# Altium schematic sheet Display.Schematic.SchDoc
size A
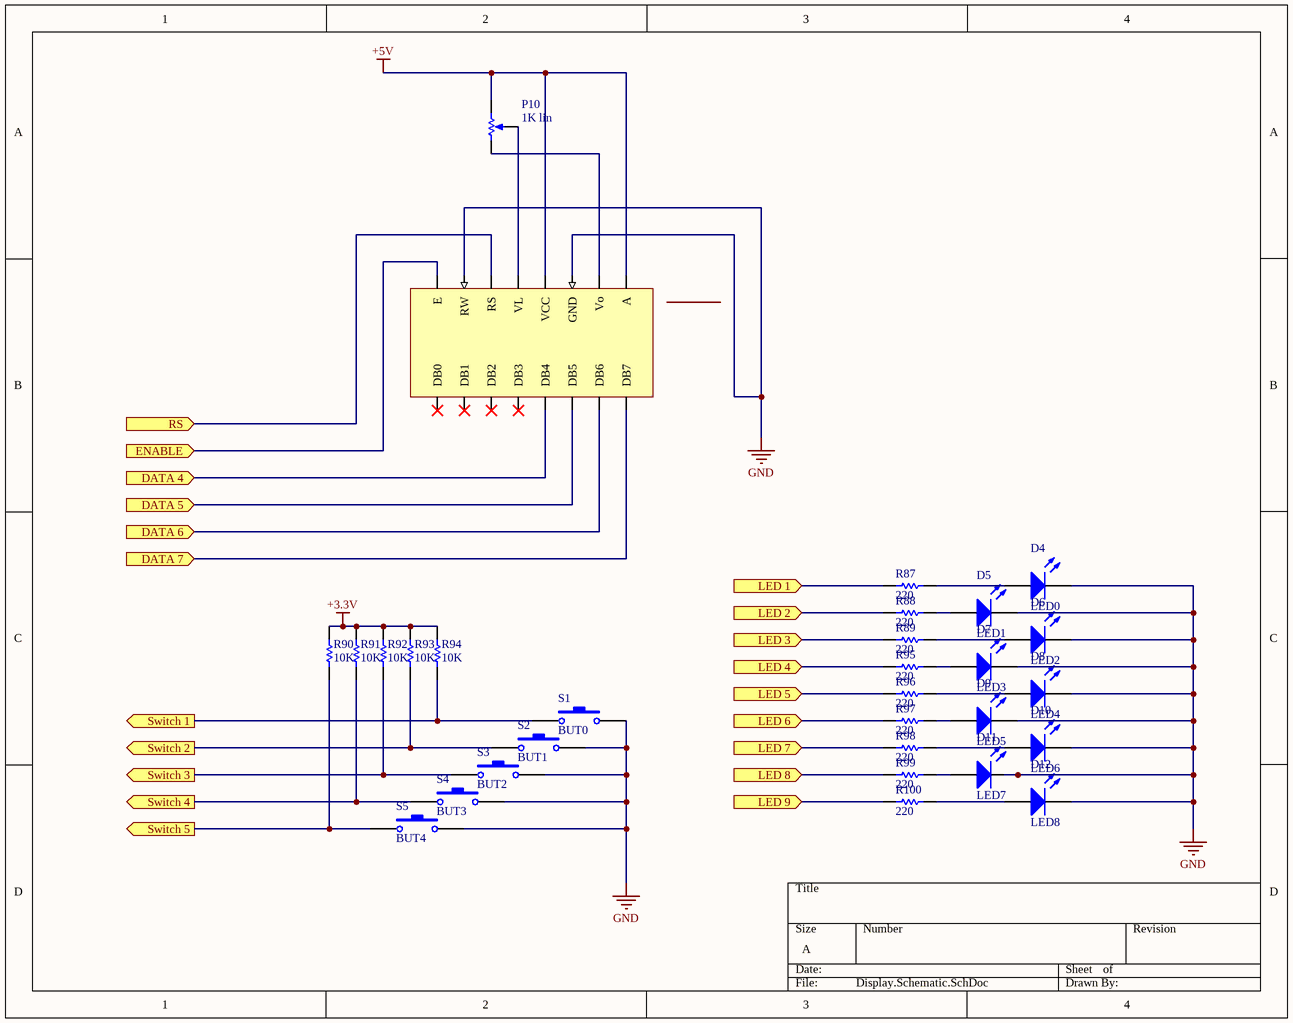
[diagram p0: Display.Schematic.SchDoc]

## Parts
D4  LED0  [LED]
D5  LED1  [LED]
D6  LED2  [LED]
D7  LED3  [LED]
D8  LED4  [LED]
D9  LED5  [LED]
D10  LED6  [LED]
D11  LED7  [LED]
D12  LED8  [LED]
Display1  16x2 LCD  [Display]  (value not drawn)
P10  1K lin  [BOURNS Trim pot]
R87  220  [CAPC1608N]
R88  220  [CAPC1608N]
R89  220  [CAPC1608N]
R90  10K  [CAPC1608N]
R91  10K  [CAPC1608N]
R92  10K  [CAPC1608N]
R93  10K  [CAPC1608N]
R94  10K  [CAPC1608N]
R95  220  [CAPC1608N]
R96  220  [CAPC1608N]
R97  220  [CAPC1608N]
R98  220  [CAPC1608N]
R99  220  [CAPC1608N]
R100  220  [CAPC1608N]
S1  BUT0  [PUSH BUTTON]
S2  BUT1  [PUSH BUTTON]
S3  BUT2  [PUSH BUTTON]
S4  BUT3  [PUSH BUTTON]
S5  BUT4  [PUSH BUTTON]

## Ports
DATA 4 (in), DATA 5 (in), DATA 6 (in), DATA 7 (in), ENABLE (in), LED 1 (in), LED 2 (in), LED 3 (in), LED 4 (in), LED 5 (in), LED 6 (in), LED 7 (in), LED 8 (in), LED 9 (in), RS (in), Switch 1 (out), Switch 2 (out), Switch 3 (out), Switch 4 (out), Switch 5 (out)

## Nets
+3.3V: R90.2 R91.2 R92.2 R93.2 R94.2
+5V: Display1.2(VCC) Display1.16(A) P10.2(BOT)
GND: D4.2(K) D5.2(K) D6.2(K) D7.2(K) D8.2(K) D9.2(K) D10.2(K) D11.2(K) D12.2(K) Display1.1(GND) Display1.5(RW) S1.2 S2.2 S3.2 S4.2 S5.2
DATA 4: Display1.10(DB4) ; port DATA 4
DATA 5: Display1.9(DB5) ; port DATA 5
DATA 6: Display1.8(DB6) ; port DATA 6
DATA 7: Display1.7(DB7) ; port DATA 7
ENABLE: Display1.6(E) ; port ENABLE
LED 1: R87.1 ; port LED 1
LED 2: R88.1 ; port LED 2
LED 3: R89.1 ; port LED 3
LED 4: R95.1 ; port LED 4
LED 5: R96.1 ; port LED 5
LED 6: R97.1 ; port LED 6
LED 7: R98.1 ; port LED 7
LED 8: R99.1 ; port LED 8
LED 9: R100.1 ; port LED 9
RS: Display1.4(RS) ; port RS
Switch 1: R94.1 S1.1 ; port Switch 1
Switch 2: R93.1 S2.1 ; port Switch 2
Switch 3: R92.1 S3.1 ; port Switch 3
Switch 4: R91.1 S4.1 ; port Switch 4
Switch 5: R90.1 S5.1 ; port Switch 5
NetD4_1: D4.1(A) R87.2
NetD5_1: D5.1(A) R88.2
NetD6_1: D6.1(A) R89.2
NetD7_1: D7.1(A) R95.2
NetD8_1: D8.1(A) R96.2
NetD9_1: D9.1(A) R97.2
NetD10_1: D10.1(A) R98.2
NetD11_1: D11.1(A) R99.2
NetD12_1: D12.1(A) R100.2
NetDisplay1_3: Display1.3(VL) P10.3(TAP)
NetDisplay1_15: Display1.15(Vo) P10.1(TOP)

Not connected (* = marked no-connect by the designer): Display1 11(DB3)* 12(DB2)* 13(DB1)* 14(DB0)*

## Library data of the parts
D4-D12 = LED0: Typical INFRARED GaAs LED; Ref_Fabricant: DX1119/RD; Fabricant: BULGIN; Published: 8-Jun-2000; LatestRevisionDate: 08-Jul-2005; LatestRevisionNote: Mech Layer 1 removed.; PackageReference: LED-0; Publisher: Altium Limited; PackageDescription: LED; 2 Leads; Ref_Farnell: 170585; Datasheet: http://www.farnell.com/datasheets/308331.pdf
Display1 = Display: Ref_Fabricant: MC21605G12W-VNMLR; Fabricant: Midas; Ref_Farnell: 2483338; Datasheet: http://www.farnell.com/datasheets/1934366.pdf
P10 = RPot: Potentiometer; Sim Note: Enter the Resistance value and the set point into parameter fields.; Set Position: 0.5; Value: 10K; Ref_Fabricant: 3362P-1-103LF; Fabricant: Bourns; Published: 8-Jun-2000; LatestRevisionDate: 17-Jul-2002; LatestRevisionNote: Re-released for DXP Platform.; PackageReference: VR5; Publisher: Altium Limited; PackageDescription: Variable Resistor, Thru-Hole; 3 Leads; Ref_Farnell: 9354301; Datasheet: http://www.farnell.com/datasheets/2034958.pdf
R87 R88 R90-R94 = Res1: Resistor; Value: 1K; Published: 8-Jun-2000; LatestRevisionDate: 17-Jul-2002; LatestRevisionNote: Re-released for DXP Platform.; PackageReference: AXIAL-0.3; Publisher: Altium Limited; PackageDescription: Axial Device, Thru-Hole; 2 Leads; 0.3 in Pin Spacing
R89 R95-R100 = Res1: Resistor; Published: 8-Jun-2000; LatestRevisionDate: 17-Jul-2002; LatestRevisionNote: Re-released for DXP Platform.; PackageReference: AXIAL-0.3; Publisher: Altium Limited; PackageDescription: Axial Device, Thru-Hole; 2 Leads; 0.3 in Pin Spacing; Value: 220
S1-S5 = SW-PB: Switch; Ref_Fabricant: TS0A22; Fabricant: MULTICOMP; Published: 24-Mar-1999; LatestRevisionDate: 17-Jul-2002; LatestRevisionNote: Re-released for DXP Platform.; PackageReference: SPST-2; Publisher: Altium Limited; PackageDescription: Switch; 2 Leads; Datasheet: http://www.farnell.com/datasheets/1662238.pdf; Ref_Farnell: 1550253